# EAGLE design SOIC40_v1_r2 (EAGLE 9.4.2)
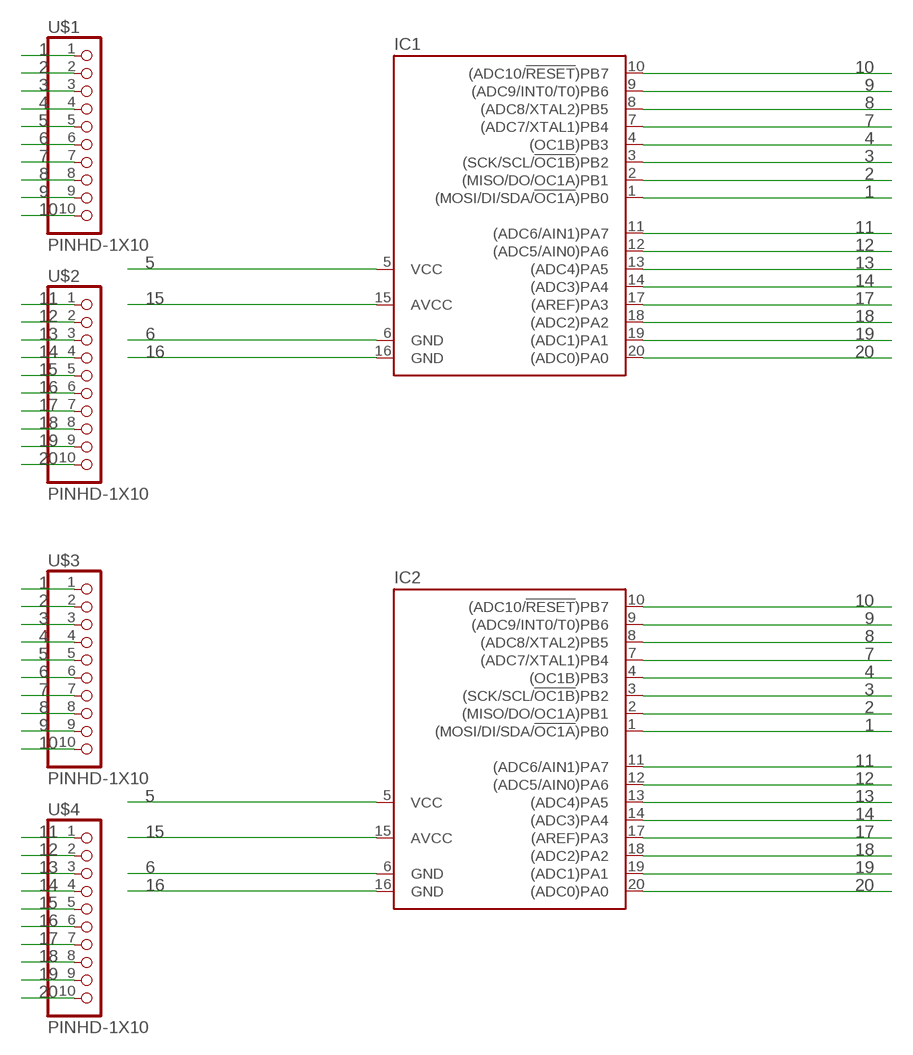
[diagram p0: schematic, sheet 1]

## Parts
IC1  TINY26LS  [SO20L]
IC2  TINY26LS  [SO20L]
U$1  PINHD-1X10  [1X10-BIG]
U$2  PINHD-1X10  [1X10-BIG]
U$3  PINHD-1X10  [1X10-BIG]
U$4  PINHD-1X10  [1X10-BIG]

## Nets
1: IC1.1((MOSI/DI/SDA/!OC1A!)PB0) IC2.1((MOSI/DI/SDA/!OC1A!)PB0) U$1.1 U$3.1
2: IC1.2((MISO/DO/OC1A)PB1) IC2.2((MISO/DO/OC1A)PB1) U$1.2 U$3.2
3: IC1.3((SCK/SCL/!OC1B!)PB2) IC2.3((SCK/SCL/!OC1B!)PB2) U$1.3 U$3.3
4: IC1.4((OC1B)PB3) IC2.4((OC1B)PB3) U$1.4 U$3.4
5: IC1.5(VCC) IC2.5(VCC) U$1.5 U$3.5
6: IC1.6(GND) IC2.6(GND) U$1.6 U$3.6
7: IC1.7((ADC7/XTAL1)PB4) IC2.7((ADC7/XTAL1)PB4) U$1.7 U$3.7
8: IC1.8((ADC8/XTAL2)PB5) IC2.8((ADC8/XTAL2)PB5) U$1.8 U$3.8
9: IC1.9((ADC9/INT0/T0)PB6) IC2.9((ADC9/INT0/T0)PB6) U$1.9 U$3.9
10: IC1.10((ADC10/!RESET!)PB7) IC2.10((ADC10/!RESET!)PB7) U$1.10 U$3.10
11: IC1.11((ADC6/AIN1)PA7) IC2.11((ADC6/AIN1)PA7) U$2.1 U$4.1
12: IC1.12((ADC5/AIN0)PA6) IC2.12((ADC5/AIN0)PA6) U$2.2 U$4.2
13: IC1.13((ADC4)PA5) IC2.13((ADC4)PA5) U$2.3 U$4.3
14: IC1.14((ADC3)PA4) IC2.14((ADC3)PA4) U$2.4 U$4.4
15: IC1.15(AVCC) IC2.15(AVCC) U$2.5 U$4.5
16: IC1.16(GND) IC2.16(GND) U$2.6 U$4.6
17: IC1.17((AREF)PA3) IC2.17((AREF)PA3) U$2.7 U$4.7
18: IC1.18((ADC2)PA2) IC2.18((ADC2)PA2) U$2.8 U$4.8
19: IC1.19((ADC1)PA1) IC2.19((ADC1)PA1) U$2.9 U$4.9
20: IC1.20((ADC0)PA0) IC2.20((ADC0)PA0) U$2.10 U$4.10

## Library data of the parts
IC1 IC2 = atmel:TINY26*: 8-bit AVR Microcontroller with 2K Bytes Flash Source: http://www.atmel.com .. doc1477.pdf; MPN: ATTINY26L-8SU; OC_FARNELL: 9171665; OC_NEWARK: 01M6921
U$1-U$4 = adafruit:PINHD-1X10: Pin header 1x10 0.1" spacing With round pins

## Board
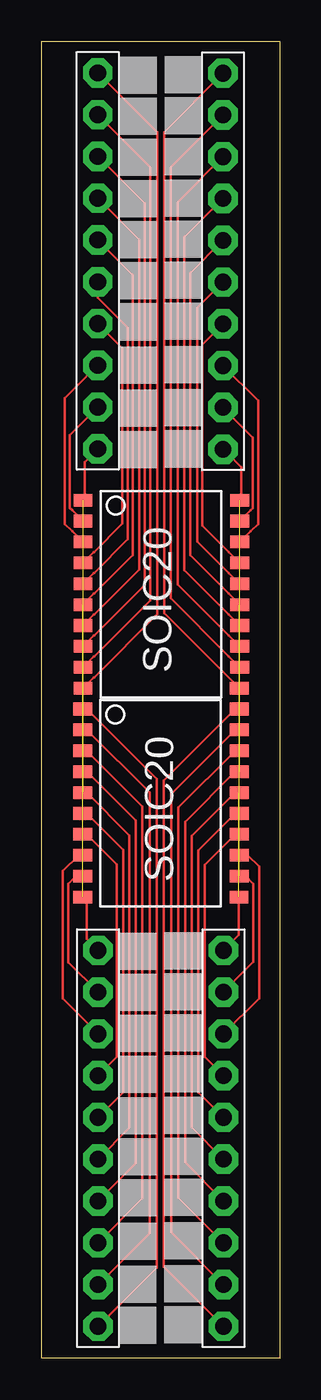
[diagram p1: board, top side]
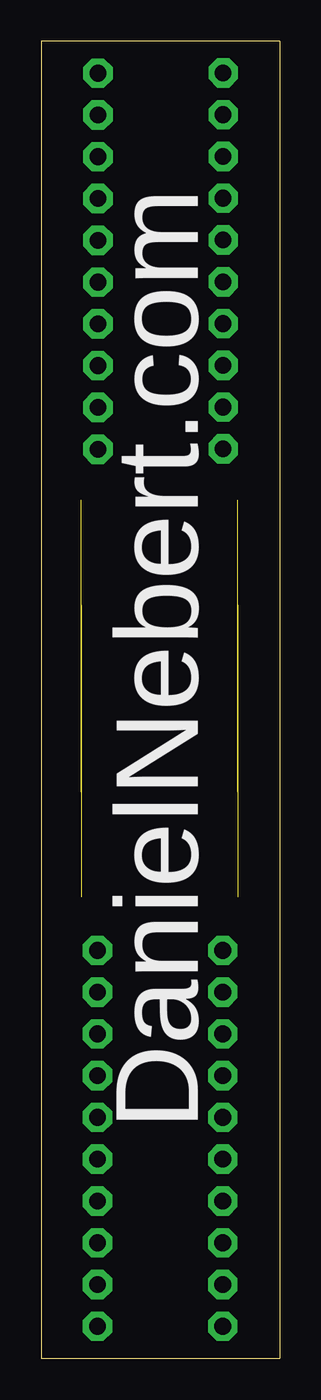
[diagram p2: board, bottom side, seen from below]

Size 14.5 x 80.08 mm. Coordinates in mm from the lower left corner, seen from the top.
Outline: 0,80.08 0,0 14.5,0 14.5,80.08 0,80.08
Copper layers (1*16): Top 0.035mm / dielectric 1.5mm / Bottom 0.035mm
Design rules "default": minimum track width 6mil, minimum drill 0.35mm, track to track 6mil, track to pad 6mil, pad to pad 6mil, via to via 6mil, smd to smd 6mil, copper to edge 40mil, drill to drill 6mil, minimum pad ring 10mil, minimum via ring 8mil, stop-mask expansion 4mil, vias tented up to drill 0mil, thermal gap 10mil

### Footprints (pad centres in the part's own frame; a part is rotated, then mirrored left to right if it is on the bottom)
SO20L = smd 0.762 x 1.143: 1 -5.08,-5.131; 2 -3.81,-5.131; 3 -2.54,-5.131; 4 -1.27,-5.131; 5 0,-5.131; 6 1.27,-5.131; 7 2.54,-5.131; 8 3.81,-5.131; 9 5.08,-5.131; 10 6.35,-5.131; 11 6.35,4.369; 12 5.08,4.394; 13 3.81,4.394; 14 2.54,4.394; 15 1.27,4.394; 16 0,4.394; 17 -1.27,4.394; 18 -2.54,4.394; 19 -3.81,4.394; 20 -5.08,4.394
1X10-BIG = drill 1.016 pad 1.778 octagon: 1 -11.43,0; 2 -8.89,0; 3 -6.35,0; 4 -3.81,0; 5 -1.27,0; 6 1.27,0; 7 3.81,0; 8 6.35,0; 9 8.89,0; 10 11.43,0

### Placement (x,y rotation side)
IC1  7.65,34.4 270 top
IC2  7.68,47.09 270 top
U$1  3.46,13.38 90 top
U$2  11.08,13.38 270 top
U$3  3.44,66.72 90 top
U$4  11.05,66.7 270 top

### Tracks (layer width: path | path; a pad name or v marks a point on that pad's centre or on a via)
1  (1 unrouted)
  Top 0.152: U$1.1 7.02,5.51 7.02,35.23 2.77,39.48 IC1.1 | IC2.1 2.64,52.26 2.64,54.49 U$3.1
2  (1 unrouted)
  Top 0.152: IC1.2 2.77,38.21 6.59,34.39 6.59,7.62 U$1.2 | IC2.2 1.89,51.56 1.88,51.56 1.75,51.7 1.75,56.14 U$3.2
3  (1 unrouted)
  Top 0.152: U$1.3 6.16,9.72 6.16,33.55 2.77,36.94 IC1.3 | U$3.3 1.44,58.37 1.44,50.73 1.88,50.29 1.89,50.29 IC2.3
4  (1 unrouted)
  Top 0.152: IC1.4 2.77,35.67 5.75,32.69 5.75,11.85 U$1.4 | IC2.4 3.21,49.02 4.93,50.74 4.93,61.42 U$3.4
5  (1 unrouted)
  Top 0.152: U$1.5 5.37,14.01 5.37,31.8 2.77,34.4 IC1.5 | IC2.5 3.21,47.75 5.26,49.8 5.26,62.67 3.44,64.49 U$3.5
6  (1 unrouted)
  Top 0.152: IC1.6 2.77,33.13 4.99,30.91 4.99,16.17 U$1.6 | IC2.6 3.21,46.48 5.58,48.85 5.58,65.85 U$3.6
7  (1 unrouted)
  Top 0.152: IC1.7 2.77,31.86 4.6,30.02 4.6,18.33 U$1.7 | U$3.7 5.95,68.02 5.95,47.95 3.21,45.21 IC2.7
8  (1 unrouted)
  Top 0.152: IC1.8 2.27,30.59 1.3,29.62 1.3,21.89 U$1.8 | IC2.8 3.21,43.94 6.29,47.01 6.29,70.22 U$3.8
9  (1 unrouted)
  Top 0.152: IC1.9 2.12,29.32 1.66,28.86 1.66,24.07 U$1.9 | U$3.9 6.62,72.43 6.62,46.08 3.21,42.67 IC2.9
10  (1 unrouted)
  Top 0.152: IC1.10 2.78,27.79 2.78,25.49 U$1.10 | IC2.10 3.21,41.4 7.05,45.24 7.05,74.54 U$3.10
11  (1 unrouted)
  Top 0.152: IC1.11 12.02,25.75 U$2.1 | IC2.11 7.47,45.32 7.47,74.55 U$4.1
12  (1 unrouted)
  Top 0.152: IC1.12 12.44,29.32 12.9,28.86 12.9,24.09 U$2.2 | U$4.2 7.87,72.41 7.87,46.21 11.41,42.67 IC2.12
13  (1 unrouted)
  Top 0.152: IC1.13 12.55,30.59 13.24,29.89 13.24,21.89 U$2.3 | IC2.13 11.41,43.94 8.3,47.05 8.3,70.3 U$4.3
14  (1 unrouted)
  Top 0.152: IC1.14 11.8,31.86 9.94,30 9.94,18.33 U$2.4 | U$4.4 8.7,68.16 8.7,47.92 11.41,45.21 IC2.14
15  (1 unrouted)
  Top 0.152: IC1.15 11.8,33.13 9.56,30.89 9.56,16.17 U$2.5 | IC2.15 11.41,46.48 9.06,48.83 9.06,65.98 U$4.5
16  (1 unrouted)
  Top 0.152: U$2.6 9.15,14.04 9.15,31.75 11.8,34.4 IC1.16 | U$4.6 9.49,63.88 9.49,49.66 11.41,47.75 IC2.16
17  (1 unrouted)
  Top 0.152: IC1.17 11.8,35.67 8.74,32.62 8.74,11.9 U$2.7 | IC2.17 11.41,49.02 9.8,50.63 9.8,61.64 U$4.7
18  (1 unrouted)
  Top 0.152: U$2.8 8.34,9.77 8.34,33.48 11.8,36.94 IC1.18 | U$4.8 13.18,58.22 13.18,50.73 12.74,50.29 12.73,50.29 IC2.18
19  (1 unrouted)
  Top 0.152: IC1.19 11.8,38.21 7.91,34.32 7.91,7.66 U$2.9 | IC2.19 12.73,51.56 12.74,51.56 12.87,51.7 12.87,55.99 U$4.9
20  (1 unrouted)
  Top 0.152: U$2.10 7.46,5.57 7.46,35.14 11.8,39.48 IC1.20 | IC2.20 12.15,52.25 12.15,54.17 U$4.10

### Text on the board
tPlace: SOIC20 | SOIC20
bPlace: DanielNebert.com